# Altium schematic sheet miscellaneous.SchDoc
size A4; SheetNumber: 5; SheetTotal: 5
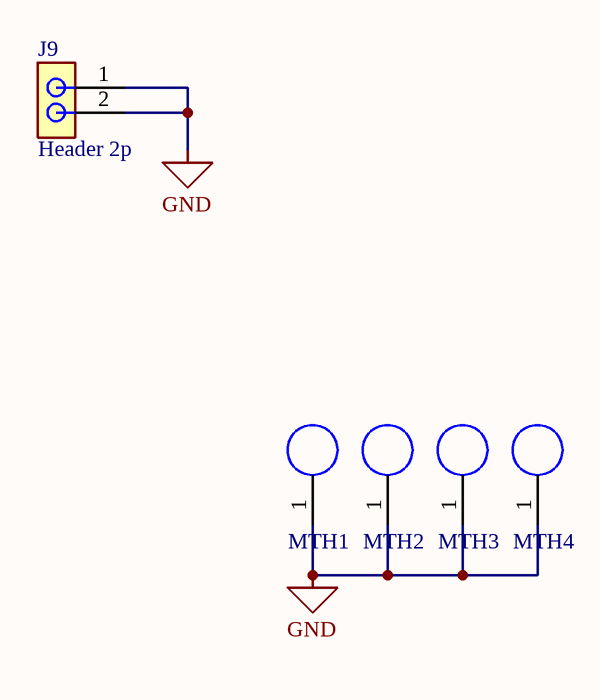
[diagram p0: miscellaneous.SchDoc]

## Parts
J9  Header 2p  [Pin header 2p]
MTH1  Hole  [3.2/6 MM]  (value not drawn)  (no BOM)
MTH2  Hole  [3.2/6 MM]  (value not drawn)  (no BOM)
MTH3  Hole  [3.2/6 MM]  (value not drawn)  (no BOM)
MTH4  Hole  [3.2/6 MM]  (value not drawn)  (no BOM)

## Nets
GND: J9.1 J9.2 MTH1.1 MTH2.1 MTH3.1 MTH4.1

## Library data of the parts
J9 = Pin header 2p: Connector; Manufacturer_Name: Connfly; Manufacturer_Part_Number: DS1021-1*2SF11-B; Basic: No; Datasheet Link: https://www.tme.com/Document/cc301e58a5da78cb543a94b5a5b7f06a/DS1021.pdf; Height: 5.88mm; JLCPCB Part: C492401
MTH1-MTH4 = Hole: Universal mounting hole plated